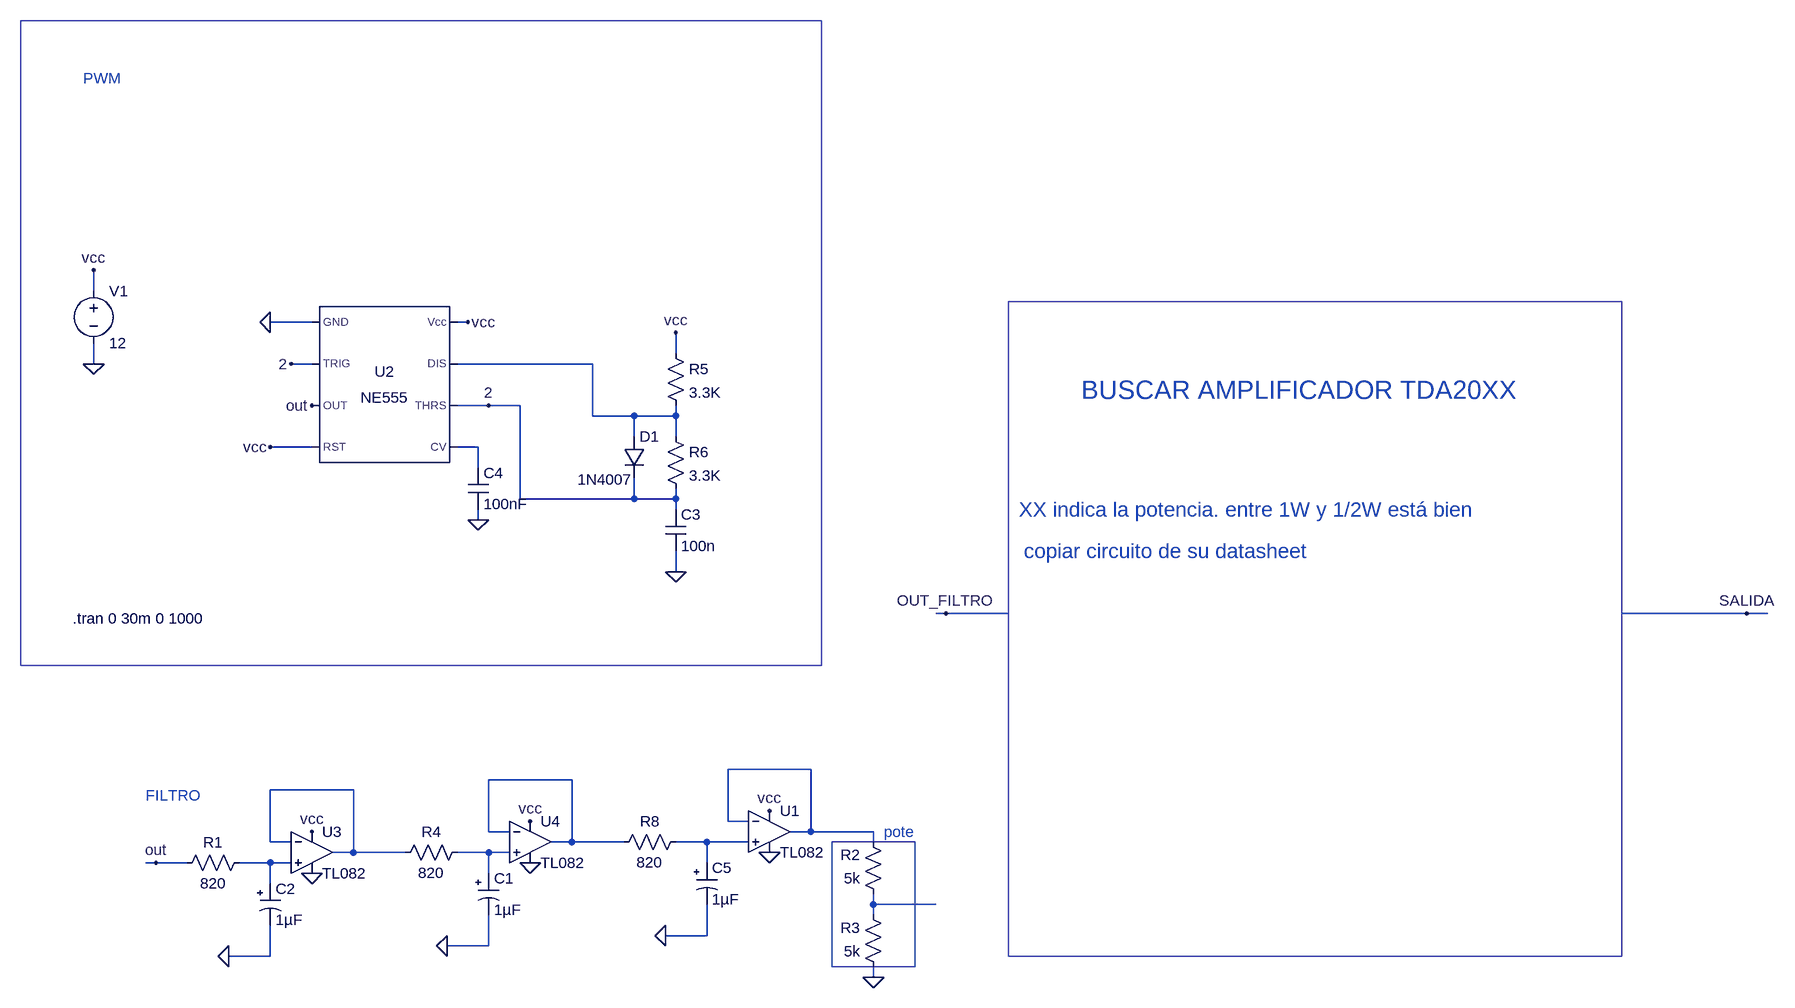
[diagram p0: schematic sonido.asc]
sonido.asc, the LTspice schematic file:
Version 4
SHEET 1 2300 1540
WIRE -304 400 -304 368
WIRE 32 448 -32 448
WIRE 272 448 256 448
WIRE 592 496 592 464
WIRE -304 512 -304 480
WIRE 32 512 0 512
WIRE 464 512 256 512
WIRE 304 576 256 576
WIRE 352 576 304 576
WIRE 464 592 464 512
WIRE 528 592 464 592
WIRE 592 592 592 576
WIRE 592 592 528 592
WIRE 528 624 528 592
WIRE 592 624 592 592
WIRE 32 640 -32 640
WIRE 288 640 256 640
WIRE 288 672 288 640
WIRE 352 720 352 576
WIRE 528 720 528 688
WIRE 528 720 352 720
WIRE 592 720 592 704
WIRE 592 720 528 720
WIRE 592 736 592 720
WIRE 288 752 288 736
WIRE 592 832 592 800
WIRE 1008 896 992 896
WIRE 1104 896 1008 896
WIRE 2240 896 2048 896
WIRE 2272 896 2240 896
WIRE 800 1136 672 1136
WIRE 432 1152 304 1152
WIRE 96 1168 -32 1168
WIRE 672 1216 672 1136
WIRE 704 1216 672 1216
WIRE 304 1232 304 1152
WIRE 336 1232 304 1232
WIRE 800 1232 800 1136
WIRE 800 1232 768 1232
WIRE 896 1232 800 1232
WIRE -32 1248 -32 1168
WIRE 0 1248 -32 1248
WIRE 432 1248 432 1152
WIRE 432 1248 400 1248
WIRE 512 1248 432 1248
WIRE 640 1248 592 1248
WIRE 704 1248 640 1248
WIRE 896 1248 896 1232
WIRE 96 1264 96 1168
WIRE 96 1264 64 1264
WIRE 176 1264 96 1264
WIRE 304 1264 256 1264
WIRE 336 1264 304 1264
WIRE -208 1280 -224 1280
WIRE -160 1280 -208 1280
WIRE -32 1280 -80 1280
WIRE 0 1280 -32 1280
WIRE 640 1280 640 1248
WIRE 304 1296 304 1264
WIRE -32 1312 -32 1280
WIRE 896 1344 896 1328
WIRE 992 1344 896 1344
WIRE 896 1360 896 1344
WIRE 640 1392 640 1344
WIRE 640 1392 576 1392
WIRE 304 1408 304 1360
WIRE 304 1408 240 1408
WIRE -32 1424 -32 1376
WIRE -32 1424 -96 1424
WIRE 896 1456 896 1440
FLAG 272 448 vcc
FLAG -32 640 vcc
FLAG -32 448 0
FLAG 592 832 0
FLAG 592 464 vcc
FLAG -304 368 vcc
FLAG -304 512 0
FLAG 0 512 2
FLAG 304 576 2
FLAG 288 752 0
FLAG 32 576 out
FLAG -96 1424 0
FLAG 32 1232 vcc
FLAG 32 1296 0
FLAG 240 1408 0
FLAG 368 1216 vcc
FLAG 368 1280 0
FLAG 576 1392 0
FLAG 2240 896 SALIDA
FLAG 1008 896 OUT_FILTRO
FLAG -208 1280 out
FLAG 736 1200 vcc
FLAG 736 1264 0
FLAG 896 1456 0
SYMBOL Misc\\NE555 144 544 R0
SYMATTR InstName U2
SYMBOL res 576 480 R0
SYMATTR InstName R5
SYMATTR Value 3.3K
SYMBOL res 576 608 R0
SYMATTR InstName R6
SYMATTR Value 3.3K
SYMBOL cap 576 736 R0
SYMATTR InstName C3
SYMATTR Value 100n
SYMBOL voltage -304 384 R0
SYMATTR InstName V1
SYMATTR Value 12
SYMBOL cap 272 672 R0
SYMATTR InstName C4
SYMATTR Value 100nF
SYMBOL diode 512 624 R0
WINDOW 3 -71 66 Left 2
SYMATTR Value 1N4007
SYMATTR InstName D1
SYMBOL res -64 1264 R90
WINDOW 0 0 56 VBottom 2
WINDOW 3 32 56 VTop 2
SYMATTR InstName R1
SYMATTR Value 820
SYMBOL Opamps\\TL082 32 1200 R0
SYMATTR InstName U3
SYMBOL res 272 1248 R90
WINDOW 0 0 56 VBottom 2
WINDOW 3 32 56 VTop 2
SYMATTR InstName R4
SYMATTR Value 820
SYMBOL Opamps\\TL082 368 1184 R0
SYMATTR InstName U4
SYMBOL res 608 1232 R90
WINDOW 0 0 56 VBottom 2
WINDOW 3 32 56 VTop 2
SYMATTR InstName R8
SYMATTR Value 820
SYMBOL polcap 288 1296 R0
SYMATTR InstName C1
SYMATTR Value 1µF
SYMBOL polcap -48 1312 R0
SYMATTR InstName C2
SYMATTR Value 1µF
SYMBOL polcap 624 1280 R0
SYMATTR InstName C5
SYMATTR Value 1µF
SYMBOL Opamps\\TL082 736 1168 R0
SYMATTR InstName U1
SYMBOL res 912 1344 R180
WINDOW 0 36 76 Left 2
WINDOW 3 36 40 Left 2
SYMATTR InstName R2
SYMATTR Value 5k
SYMBOL res 912 1456 R180
WINDOW 0 36 76 Left 2
WINDOW 3 36 40 Left 2
SYMATTR InstName R3
SYMATTR Value 5k
TEXT -336 904 Left 2 !.tran 0 30m 0 1000
TEXT -320 72 Left 2 ;PWM
TEXT -224 1176 Left 2 ;FILTRO
TEXT 1216 552 Left 4 ;BUSCAR AMPLIFICADOR TDA20XX
TEXT 1120 736 Left 3 ;XX indica la potencia. entre 1W y 1/2W está bien
TEXT 1128 800 Left 3 ;copiar circuito de su datasheet
TEXT 912 1232 Left 2 ;pote
RECTANGLE Normal -416 -16 816 976
RECTANGLE Normal 1104 416 2048 1424
RECTANGLE Normal 832 1248 960 1440

The netlist it stands for:
* sonido.asc
XU2 0 2 out vcc N002 2 N001 vcc NE555  ; pins GND TRIG OUT RST CV THRS DIS Vcc
R5 vcc N001 3.3K
R6 N001 2 3.3K
C3 2 0 100n
V1 vcc 0 12
C4 N002 0 100nF
D1 N001 2 1N4007
R1 N008 out 820
XU3 N008 N005 vcc 0 N005 TL082  ; pins In+ In- V+ V- OUT
R4 N007 N005 820
XU4 N007 N004 vcc 0 N004 TL082  ; pins In+ In- V+ V- OUT
R8 N006 N004 820
C1 N007 0 1µF
C2 N008 0 1µF
C5 N006 0 1µF
XU1 N006 N003 vcc 0 N003 TL082  ; pins In+ In- V+ V- OUT
R2 N009 N003 5k
R3 0 N009 5k
.model D D
.lib standard.dio
.tran 0 30m 0 1000
* PWM
* FILTRO
* BUSCAR AMPLIFICADOR TDA20XX
* XX indica la potencia. entre 1W y 1/2W está bien
* copiar circuito de su datasheet
* pote
.lib NE555.sub
.backanno
.end